# EAGLE design MPU (EAGLE 7.2.0)

## Sheet 1 of 2
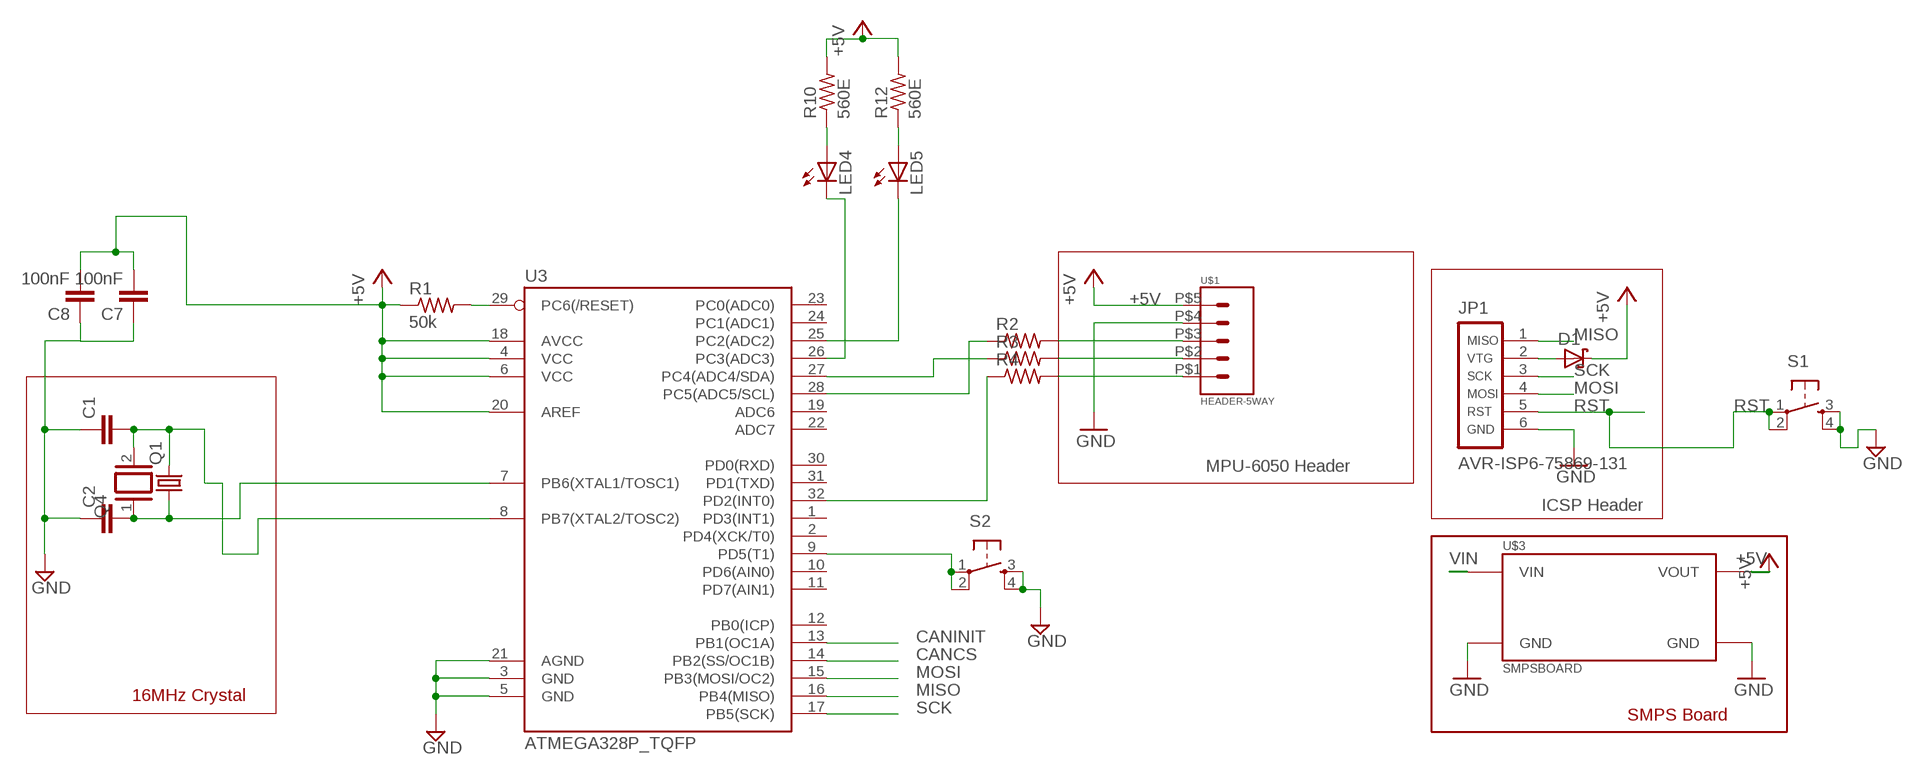
[diagram p0: schematic, sheet 1]

### Parts
C1  C-EUC0805  [C0805]
C2  C-EUC0805  [C0805]
C7  100nF  C-EUC0805  [C0805]
C8  100nF  C-EUC0805  [C0805]
D1  SCHOTTKY-DIODESMD  [SMB]
JP1  AVR-ISP6-75869-131  [HDR-75869-131]
LED4  LEDCHIP-LED0805  [CHIP-LED0805]
LED5  LEDCHIP-LED0805  [CHIP-LED0805]
Q1  CRYSTALHC49UP  [HC49UP]
Q4  XTAL/S  [QS]
R1  50k  R-US_M0805  [M0805]
R2  R-US_M0805  [M0805]
R3  R-US_M0805  [M0805]
R4  R-US_M0805  [M0805]
R10  560E  R-US_M0805  [M0805]
R12  560E  R-US_M0805  [M0805]
S1  TAC_SWITCHSMD  [TACTILE_SWITCH_SMD]
S2  TAC_SWITCHSMD  [TACTILE_SWITCH_SMD]
U3  ATMEGA328P_TQFP  [TQFP32-08]
U$1  HEADER-5WAY  [1744426-5]
U$3  SMPSBOARD  [SMPSBOARD]

### Nets
+5V: C7.2 C8.2 D1.C R1.1 R10.2 R12.2 U3.4(VCC) U3.6(VCC) U3.18(AVCC) U3.20(AREF) U$1.P$5 U$3.VOUT ; also sheet 2
CANCS: U3.14(PB2(SS/OC1B)) ; also sheet 2
CANINIT: U3.13(PB1(OC1A))
GND: C1.1 C2.1 C7.1 C8.1 JP1.6 S1.3 S1.4 S2.3 S2.4 U3.3(GND) U3.5(GND) U3.21(AGND) U$1.P$4 U$3.GND U$3.GND@(GND) ; also sheet 2
INT: R4.2 U$1.P$1
MISO: JP1.1 U3.16(PB4(MISO)) ; also sheet 2
MOSI: JP1.4 U3.15(PB3(MOSI/OC2)) ; also sheet 2
N$5: R2.1 U3.28(PC5(ADC5/SCL))
N$6: R3.1 U3.27(PC4(ADC4/SDA))
N$7: R4.1 U3.32(PD2(INT0))
N$8: LED5.C U3.25(PC2(ADC2))
N$9: C2.2 Q1.1 Q4.1 U3.7(PB6(XTAL1/TOSC1))
N$10: S2.1 S2.2 U3.9(PD5(T1))
N$11: R1.2 U3.29(PC6(/RESET))
N$12: LED4.A R10.1
N$14: LED5.A R12.1
N$15: LED4.C U3.26(PC3(ADC3))
N$16: D1.A JP1.2
N$17: C1.2 Q1.2 Q4.2 U3.8(PB7(XTAL2/TOSC2))
RST: JP1.5 S1.1 S1.2
SCK: JP1.3 U3.17(PB5(SCK)) ; also sheet 2
SCL: R2.2 U$1.P$3
SDA: R3.2 U$1.P$2
VIN: U$3.VIN ; also sheet 2
Unconnected: U3.1(PD3(INT1)) U3.2(PD4(XCK/T0)) U3.10(PD6(AIN0)) U3.11(PD7(AIN1)) U3.12(PB0(ICP)) U3.19(ADC6) U3.22(ADC7) U3.23(PC0(ADC0)) U3.24(PC1(ADC1)) U3.30(PD0(RXD)) U3.31(PD1(TXD))

### Notes on the sheet
- MPU-6050 Header
- ICSP Header
- 16MHz Crystal
- SMPS Board

## Sheet 2 of 2
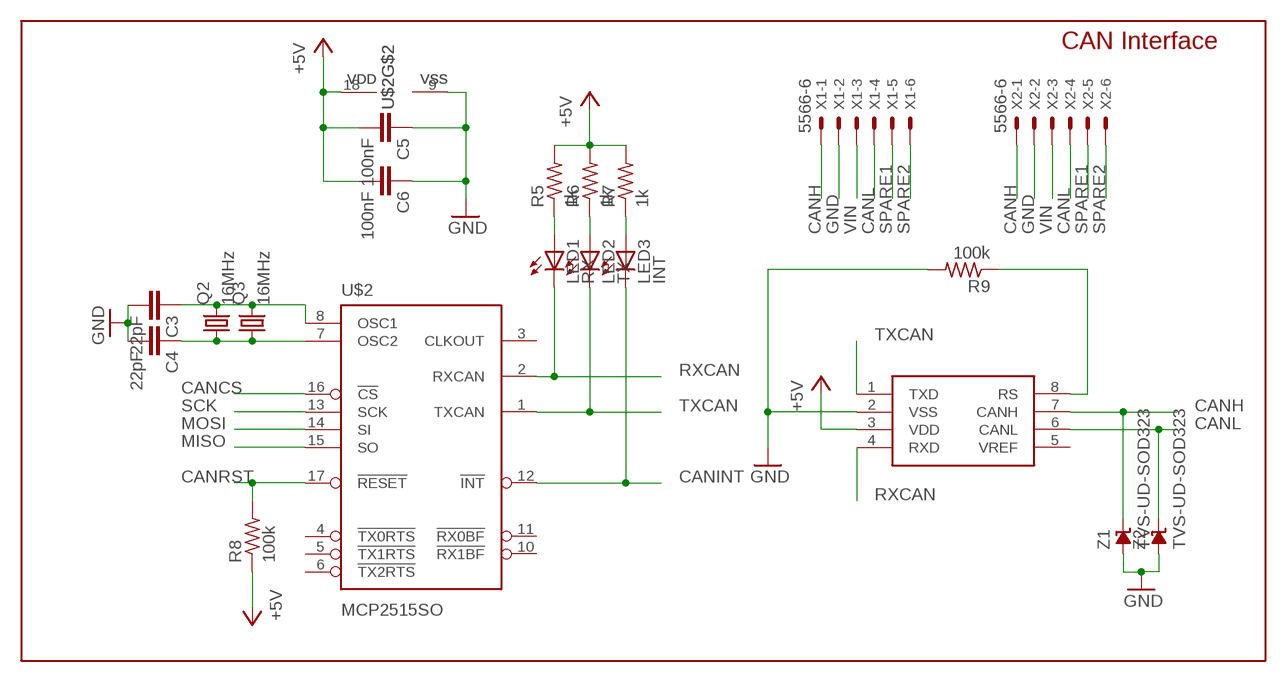
[diagram p1: schematic, sheet 2]

### Parts
C3  22pF  C-EUC0805K  [C0805K]
C4  22pF  C-EUC0805K  [C0805K]
C5  100nF  C-EUC0805K  [C0805K]
C6  100nF  C-EUC0805K  [C0805K]
LED1  RX  LEDCHIP-LED0805  [CHIP-LED0805]
LED2  TX  LEDCHIP-LED0805  [CHIP-LED0805]
LED3  INT  LEDCHIP-LED0805  [CHIP-LED0805]
Q2  16MHz  CRYSTALHC49S  [HC49/S]
Q3  16MHz  CRYSTALHC49UP  [HC49UP]
R5  1k  R-US_R0805  [R0805]
R6  1k  R-US_R0805  [R0805]
R7  1k  R-US_R0805  [R0805]
R8  100k  R-US_R0805  [R0805]
R9  100k  R-US_R0805  [R0805]
U2  MCP2551  [SO08]
U$2  MCP2515SO  [SO-18W]
X1  5566-6  [5566-6]
X2  5566-6  [5566-6]
Z1  TVS-UD-SOD323  [SOD323]
Z2  TVS-UD-SOD323  [SOD323]

### Nets
+5V: C5.2 C6.2 R5.2 R6.2 R7.2 R8.1 U2.3(VDD) U$2.18(VDD) ; also sheet 1
CANCS: U$2.16(!CS) ; also sheet 1
CANH: U2.7(CANH) X1.1 X2.1 Z1.C
CANINT: LED3.C U$2.12(!INT)
CANL: U2.6(CANL) X1.4 X2.4 Z2.C
CANRST: R8.2 U$2.17(!RESET)
CANSTBY: R9.1 U2.8(RS)
GND: C3.2 C4.2 C5.1 C6.1 R9.2 U2.2(VSS) U$2.9(VSS) X1.2 X2.2 Z1.A Z2.A ; also sheet 1
MISO: U$2.15(SO) ; also sheet 1
MOSI: U$2.14(SI) ; also sheet 1
N$1: LED1.A R5.1
N$2: LED2.A R6.1
N$3: LED3.A R7.1
N$4: C3.1 Q2.2 Q3.2 U$2.8(OSC1)
N$13: C4.1 Q2.1 Q3.1 U$2.7(OSC2)
RXCAN: LED1.C U2.4(RXD) U$2.2(RXCAN)
SCK: U$2.13(SCK) ; also sheet 1
SPARE1: X1.5 X2.5
SPARE2: X1.6 X2.6
TXCAN: LED2.C U2.1(TXD) U$2.1(TXCAN)
VIN: X1.3 X2.3 ; also sheet 1
Unconnected: U2.5(VREF) U$2.3(CLKOUT) U$2.4(!TX0RTS) U$2.5(!TX1RTS) U$2.6(!TX2RTS) U$2.10(!RX1BF) U$2.11(!RX0BF)

### Notes on the sheet
- CAN Interface

## Library data of the parts
C1-C8 = resistor:C-EU: CAPACITOR, European symbol
D1 = diode:SCHOTTKY-DIODE: Schottky Diode
JP1 = atmel-avr:AVR-ISP6-: AVR ISP-6 Serial Programming Header
LED1-LED5 = led:LED: LED OSRAM: - CHIPLED LG R971, LG N971, LY N971, LG Q971, LY Q971, LO R971, LY R971 LH N974, LH R974 LS Q976, LO Q976, LY Q976 LO Q996 - Hyper CHIPLED LW Q18S LB Q993, LB Q99A, LB R99A - SideLED LS A670, LO A670, LY A670, LG A670, LP A670 LB A673, LV A673, LT A673, LW A673 LH A674 LY A675 LS A676, LA A676, LO A676, LY A676, LW A676 LS A679, LY A679, LG A679 - Hyper Micro SIDELED® LS Y876, LA Y876, LO Y876, LY Y876 LT Y87S - SmartLED LW L88C, LW L88S LB L89C, LB L89S, LG L890 LS L89K, LO L89K, LY L89K LS L896, LA L896, LO L896, LY L896 - TOPLED LS T670, LO T670, LY T670, LG T670, LP T670 LSG T670, LSP T670, LSY T670, LOP T670, LYG T670 LG T671, LOG T671, LSG T671 LB T673, LV T673, LT T673, LW T673 LH T674 LS T676, LA T676, LO T676, LY T676, LB T676, LH T676, LSB T676, LW T676 LB T67C, LV T67C, LT T67C, LS T67K, LO T67K, LY T67K, LW E67C LS E67B, LA E67B, LO E67B, LY E67B, LB E67C, LV E67C, LT E67C LW T67C LS T679, LY T679, LG T679 LS T770, LO T770, LY T770, LG T770, LP T770 LB T773, LV T773, LT T773, LW T773 LH T774 LS E675, LA E675, LY E675, LS T675 LS T776, LA T776, LO T776, LY T776, LB T776 LHGB T686 LT T68C, LB T68C - Hyper Mini TOPLED® LB M676 - Mini TOPLED Santana® LG M470 LS M47K, LO M47K, LY M47K Source: http://www.osram.convergy.de LUXEON: - LUMILED® LXK2-PW12-R00, LXK2-PW12-S00, LXK2-PW14-U00, LXK2-PW14-V00 LXK2-PM12-R00, LXK2-PM12-S00, LXK2-PM14-U00 LXK2-PE12-Q00, LXK2-PE12-R00, LXK2-PE12-S00, LXK2-PE14-T00, LXK2-PE14-U00 LXK2-PB12-K00, LXK2-PB12-L00, LXK2-PB12-M00, LXK2-PB14-N00, LXK2-PB14-P00, LXK2-PB14-Q00 LXK2-PR12-L00, LXK2-PR12-M00, LXK2-PR14-Q00, LXK2-PR14-R00 LXK2-PD12-Q00, LXK2-PD12-R00, LXK2-PD12-S00 LXK2-PH12-R00, LXK2-PH12-S00 LXK2-PL12-P00, LXK2-PL12-Q00, LXK2-PL12-R00 Source: www.luxeon.com KINGBRIGHT: KA-3528ASYC Source: www.kingbright.com
Q1 Q3 = crystal:CRYSTAL: CRYSTAL; OC_FARNELL: unknown; OC_NEWARK: unknown
Q2 = crystal:CRYSTAL: CRYSTAL; OC_FARNELL: 1667008; OC_NEWARK: unknown
Q4 = special:XTAL/S: CRYSTAL
R1-R10 R12 = resistor:R-US_: RESISTOR, American symbol
S1 S2 = SparkFun:TAC_SWITCH: Momentary Switch Button commonly used for reset or general input. Spark Fun Electronics SKU : COM-00097
U2 = SparkFun:MCP2551
U3 = SparkFun-DigitalIC:ATMEGA328P_TQFP; PROD_ID: IC-09069
U$1 = con-TE-EP:HEADER-5WAY
U$2 = RobThePyro:MCP2515: MCP2515 CAN Controller by Microchip
U$3 = RobThePyro:SMPSBOARD
X1 X2 = con-molex:5566-6: Mini FIT connector 6 pol Source: http://www.molex.com; MPN: 95566-61002; OC_FARNELL: unknown; OC_NEWARK: 22K8620
Z1 Z2 = supressor:TVS-UD-: TVS UNI-DIRECTIONAL

## Board
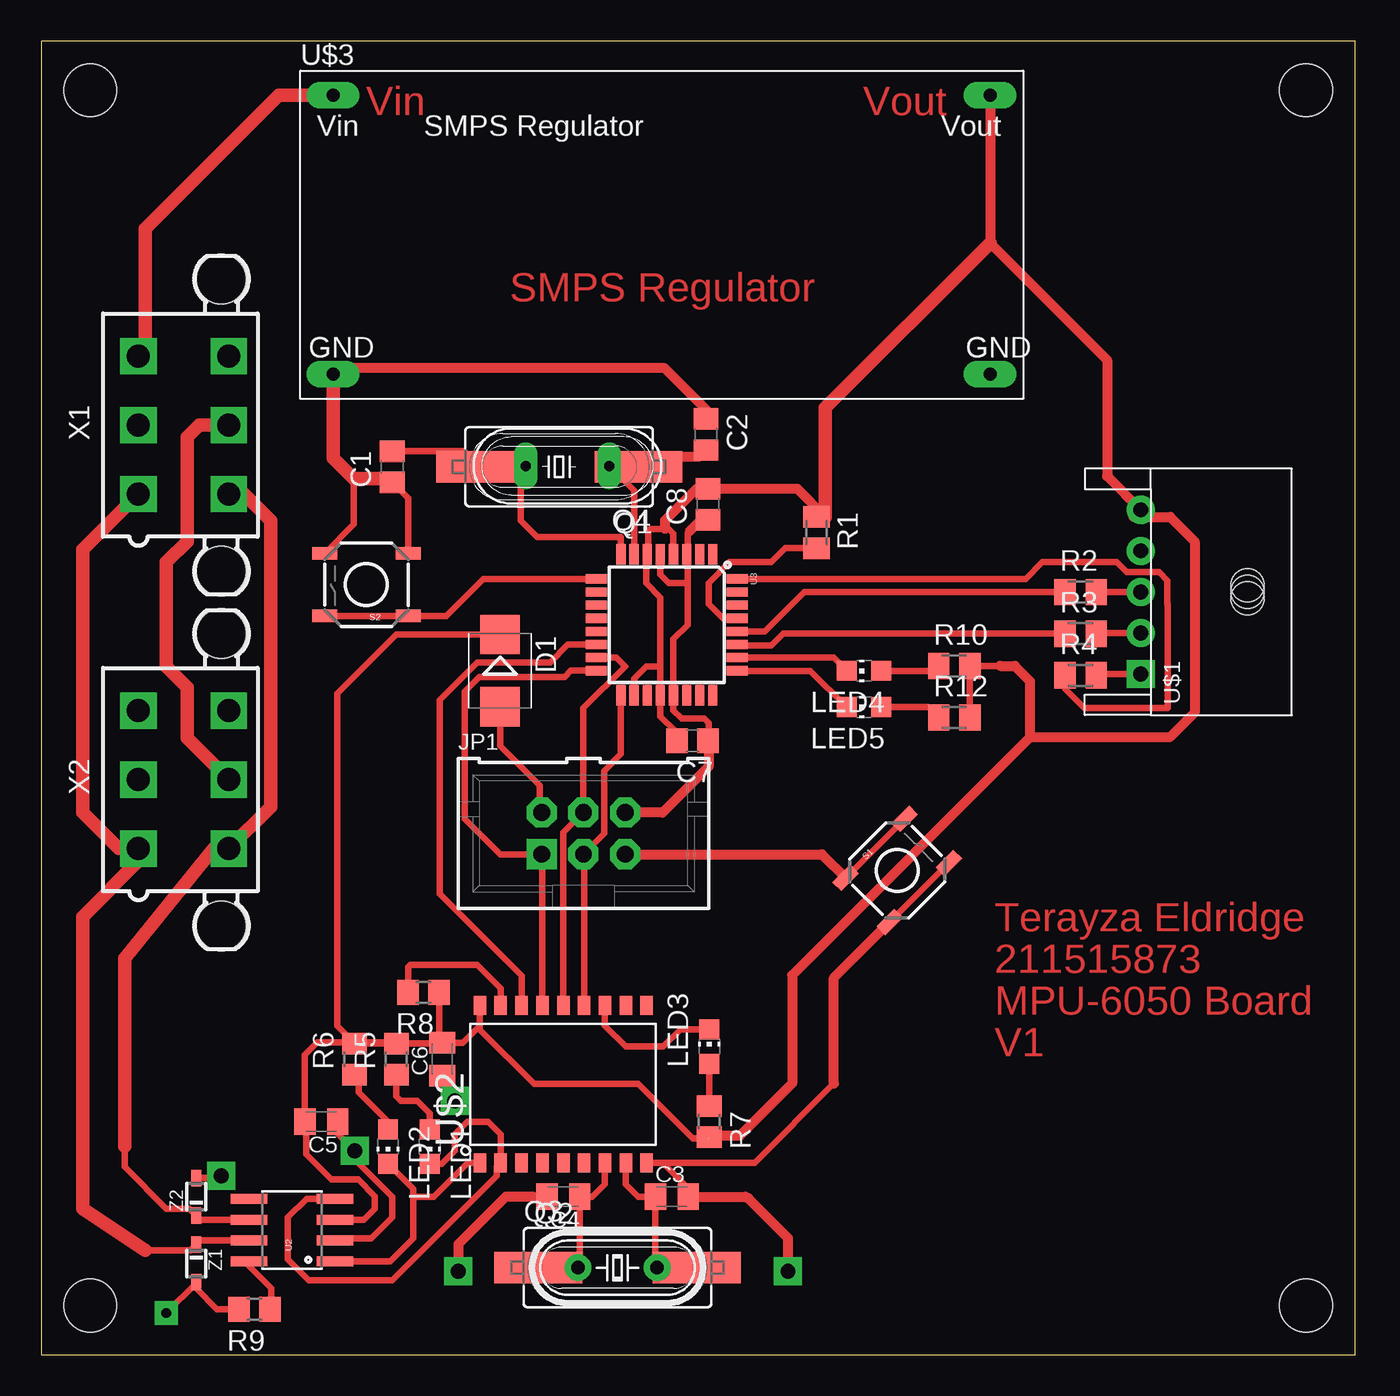
[diagram p2: board, top side]
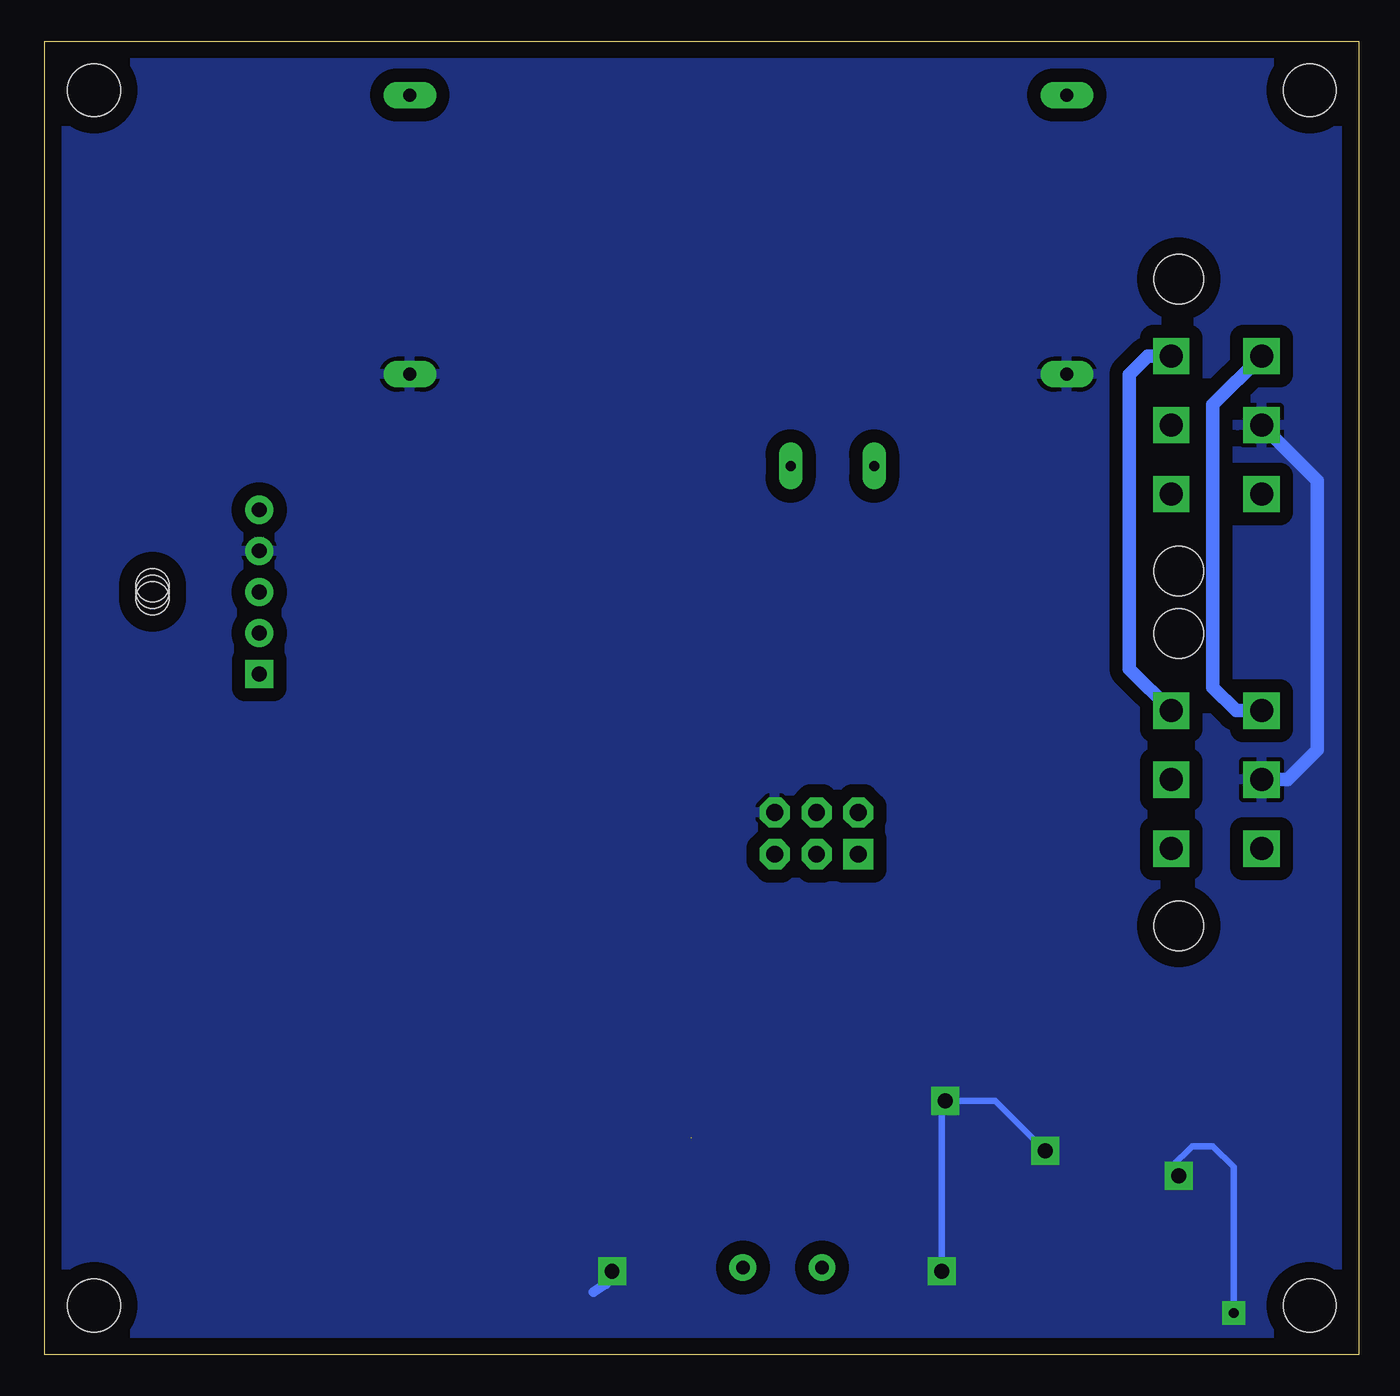
[diagram p3: board, bottom side, seen from below]

Size 80 x 80 mm. Coordinates in mm from the lower left corner, seen from the top.
Outline: 0,0 80,0 80,80 0,80 0,0
Copper layers (1*16): Top 0.035mm / dielectric 1.5mm / Bottom 0.035mm
Design rules "default *": minimum track width 10mil, minimum drill 24mil, track to track 8mil, track to pad 8mil, pad to pad 8mil, via to via 8mil, smd to smd 8mil, copper to edge 40mil, drill to drill 8mil, minimum pad ring 16mil, minimum via ring 16mil, stop-mask expansion 4mil, vias tented up to drill 0mil, thermal gap 10mil
Holes 3.2 mm at 3,3 77,3 77,77 3,77

### Footprints (pad centres in the part's own frame; a part is rotated, then mirrored left to right if it is on the bottom)
C0805 = smd 1.3 x 1.5: 1 -0.95,0; 2 0.95,0
C0805K = smd 1.3 x 1.6: 1 -1,0; 2 1,0
SMB = smd 2.4 x 2.4: A 2.2,0; C -2.2,0
HDR-75869-131 = drill 1.016 pad 1.676 square: 1 -2.54,-1.27 | drill 1.016 pad 1.676 octagon: 2 -2.54,1.27; 3 0,-1.27; 4 0,1.27; 5 2.54,-1.27; 6 2.54,1.27
CHIP-LED0805 = smd 1.2 x 1.2: A 0,-1.05; C 0,1.05
HC49UP = smd 5.334 x 1.93: 1 -4.826,0; 2 4.826,0
HC49/S = drill 0.813: 1 -2.413,0; 2 2.413,0
QS = drill 0.61 long: 1 -2.54,0; 2 2.54,0
M0805 = smd 1.3 x 1.6: 1 -0.95,0; 2 0.95,0
R0805 = smd 1.3 x 1.5: 1 -0.95,0; 2 0.95,0
TACTILE_SWITCH_SMD = smd 1.524 x 0.762: 1 -2.54,1.905; 2 2.54,1.905; 3 -2.54,-1.905; 4 2.54,-1.905
SO08 = smd 0.61 x 2.21: 1 -1.905,-2.616; 2 -0.635,-2.616; 3 0.635,-2.616; 4 1.905,-2.616; 5 1.905,2.616; 6 0.635,2.616; 7 -0.635,2.616; 8 -1.905,2.616
TQFP32-08 = smd 1.27 x 0.559: 1 -4.293,2.8; 2 -4.293,2; 3 -4.293,1.2; 4 -4.293,0.4; 5 -4.293,-0.4; 6 -4.293,-1.2; 7 -4.293,-2; 8 -4.293,-2.8; 17 4.293,-2.8; 18 4.293,-2; 19 4.293,-1.2; 20 4.293,-0.4; 21 4.293,0.4; 22 4.293,1.2; 23 4.293,2; 24 4.293,2.8 | smd 0.559 x 1.27: 9 -2.8,-4.293; 10 -2,-4.293; 11 -1.2,-4.293; 12 -0.4,-4.293; 13 0.4,-4.293; 14 1.2,-4.293; 15 2,-4.293; 16 2.8,-4.293; 25 2.8,4.293; 26 2,4.293; 27 1.2,4.293; 28 0.4,4.293; 29 -0.4,4.293; 30 -1.2,4.293; 31 -2,4.293; 32 -2.8,4.293
1744426-5 = drill 0.9 square: P$1 -5,6.5 | drill 0.9: P$2 -2.5,6.5; P$3 0,6.5; P$4 2.5,6.5; P$5 5,6.5 | hole 2: 0,0; -0.4,0; 0.4,0
SO-18W = smd 0.762 x 1.143: 1 -5.08,-4.788; 2 -3.81,-4.788; 3 -2.54,-4.788; 4 -1.27,-4.788; 5 0,-4.788; 6 1.27,-4.788; 7 2.54,-4.788; 8 3.81,-4.788; 9 5.08,-4.788; 10 5.08,4.788; 11 3.81,4.788; 12 2.54,4.788; 13 1.27,4.788; 14 0,4.788; 15 -1.27,4.788; 16 -2.54,4.788; 17 -3.81,4.788; 18 -5.08,4.788
SMPSBOARD = drill 0.8 long: GND 2,1.5; GND@ 42,1.5; VIN 2,18.5; VOUT 42,18.5
5566-6 = drill 1.4 square: 1 4.2,-2.75; 2 0,-2.75; 3 -4.2,-2.75; 4 4.2,2.75; 5 0,2.75; 6 -4.2,2.75 | hole 3: 8.9,2.29; -8.9,2.29
SOD323 = smd 1 x 0.6: A 1.143,0; C -1.143,0

### Placement (x,y rotation side)
C1  21.38,54.07 90 top
C2  40.47,56.04 270 top
C3  38.39,9.62 0 top
C4  31.79,9.62 180 top
C5  17.06,14.19 180 top
C6  24.42,18 90 top
C7  39.65,37.39 180 top
C8  40.61,51.79 90 top
D1  27.94,41.66 270 top
JP1  33.02,31.75 0 top
LED1  23.66,12.67 180 top
LED2  21.12,12.67 180 top
LED3  40.68,18.77 0 top
LED4  50.1,41.65 90 top
LED5  50.1,39.44 90 top
Q1  31.54,54.07 180 top
Q2  35.09,5.3 0 top
Q3  35.09,5.3 0 top
Q4  32.05,54.12 180 top
R1  47.2,50.07 270 top
R2  63.29,46.45 0 top
R3  63.29,43.91 0 top
R4  63.29,41.37 0 top
R5  21.63,18 90 top
R6  19.09,18 90 top
R7  40.68,14.19 270 top
R8  23.28,22.07 180 top
R9  12.99,2.76 180 top
R10  55.6,41.94 0 top
R12  55.6,38.8 0 top
S1  52.12,29.49 45 top
S2  19.8,46.9 180 top
U2  15.28,7.59 90 top
U3  38.1,44.45 270 top
U$1  73.45,46.45 90 top
U$2  31.79,16.48 0 top
U$3  15.78,58.21 0 top
X1  8.68,56.61 270 top
X2  8.68,35.02 270 top
Z1  9.44,5.56 270 top
Z2  9.44,9.62 90 top

### Tracks (layer width: path | path; a pad name or v marks a point on that pad's centre or on a via)
+5V  (1 unrouted)
  Top 0.406: R6.2 R5.2 24.38,18.95 C6.2 | R6.2 21.06,19.02 16.8,19.02 16.06,18.27 C5.2 16.13,14.12 16.13,12.19 17.65,10.67 19.3,10.67 20.32,9.65 20.32,8.89 19.66,8.22 U2.3 | 26.71,20.04 26.71,19.78 30.01,16.48 36.36,16.48 39.66,13.18 40.62,13.18 R7.2 | 26.71,20.04 U$2.18 | C6.2 25.68,19 26.71,20.04 | 37.7,41.91 U3.20 37.7,38.88 38.61,37.97 38.61,37.48 C7.2 | 37.7,41.91 37.7,46.12 36.83,46.99 36.83,48.67 U3.6 36.96,48.8 36.96,50.16 37.08,50.29 37.97,50.29 38.23,50.29 38.5,50.02 U3.4 | R12.2 R10.2 58.39,41.94 | U3.18 36.1,41.18 36.83,41.91 37.7,41.91 | 66.04,52.36 U$1.P$5 | R8.1 24.23,19.2 C6.2 | D1.C 21.63,43.86 18.03,40.26 18.03,20.01 R6.2
  Top 0.61: U$3.VOUT 57.78,67.7 64.9,60.58 64.9,53.5 U$1.P$5 66.51,51.02 68.74,51.02 70.23,49.53 70.23,39.12 68.71,37.59 60.2,37.59 | R1.1 47.75,51.02 46.03,52.74 C8.2 39.91,52.74 37.97,50.8 37.97,50.29 | 60.2,37.59 45.72,23.11 45.72,16.51 42.55,13.34 40.77,13.34 40.64,13.21 | 58.39,41.94 59.28,41.94 60.2,41.02 60.2,37.59
  Top 0.813: 47.75,51.02 47.75,57.67 57.78,67.7
CANCS
  Top 0.406: U$2.16 29.25,23.07 24.26,28.07 24.26,39.88 26.54,42.16 30.99,42.16 32.07,43.25 U3.14
CANH
  Top 0.406: U2.7 9.69,6.96 Z1.C 9.09,6.35 6.35,6.35
  Top 0.813: X1.1 2.54,49.02 2.54,33.02 4.74,30.82 X2.1 5.93,30.06 2.54,26.67 2.54,8.89 6.35,6.35
CANINT
  Top 0.406: LED3.C 38.94,19.82 37.89,18.77 35.6,18.77 34.33,20.04 U$2.12
CANL
  Top 0.406: U2.6 9.69,8.22 Z2.C 9.03,8.89 7.62,8.89 5.08,11.43 5.08,12.7
  Top 0.813: X1.4 12.36,52.41 13.97,50.8 13.97,33.37 X2.4 10.5,30.82 5.08,24.13 5.08,12.7
CANRST
  Top 0.406: U$2.17 27.98,22.31 26.54,23.75 22.48,23.75 22.35,23.62 22.35,22.09 R8.2
CANSTBY
  Top 0.406: U2.8 12.66,5.38 14.01,4.03 14.01,2.83 R9.1
GND  (via drill 0.6, 0.9, 0.9 pad 1.42)
  Top 0.406: U$2.9 37.85,11.69 | R9.2 10.71,2.76 9.44,4.03 Z1.A 9.44,4.36 v7.62,2.54 | C6.1 24.43,16.23 v25.19,15.46 | Z2.A 10.84,10.77 v10.96,10.89 | C5.1 18.06,13.45 v19.09,12.42 19.09,11.91 21.38,9.62 21.38,8.35 20.11,7.08 18.02,7.08 U2.2 | 39.37,47.12 39.37,44.45 38.5,43.58 U3.21 38.48,40.14 38.48,39.24 38.99,38.73 40.39,38.73 40.64,38.48 40.64,37.42 C7.1 | 39.37,47.12 39.37,48.67 U3.3 39.37,48.81 39.37,50.04 39.5,50.16 | S1.4 52.03,26.71 S1.3 | 19.05,53.34 19.05,50.59 S2.4 | S2.3 22.34,52.16 C1.1 | C4.2 29.94,9.62 | U$2.9 43.44,11.69 48.26,16.51 | U$2.9 37.84,11.69 39.37,10.16 39.37,9.65 C3.2 | U3.5 37.7,47.52 38.23,46.99 39.24,46.99 39.37,47.12
  Top 0.61: C2.1 40.47,57.57 37.97,60.07 18.14,60.07 U$3.GND | 39.5,50.16 40.17,50.84 C8.1 | C7.1 40.64,37.35 40.64,35.81 37.85,33.02 JP1.6 | 55.34,29.94 S1.4 | 48.26,16.51 48.26,22.93 52.03,26.71 | 29.94,9.62 28.29,9.62 25.4,6.73 v25.4,5.08 | C3.2 42.9,9.62 43.05,9.53 45.47,7.11 v45.47,5.08
  Top 0.813: U$3.GND 17.78,54.61 19.05,53.34 21.16,53.34 C1.1
  Bottom 0.406: v7.62,2.54 7.62,11.43 8.89,12.7 10.16,12.7 11.43,11.43 11.43,11.36 v10.96,10.89 | v19.09,12.42 22.14,15.46 v25.19,15.46 25.4,15.25 v25.4,5.08
  Bottom 0.61: v45.47,5.08 45.85,4.32 46.61,3.81
  Bottom 0.813: X2.2 4.35,35.02 2.54,36.83 2.54,53.23 X1.2
  pour Bottom (isolate 0.813): 0,0 80,0 80,80 0,80
INT
  Top 0.406: U$1.P$1 64.32,41.45 R4.2
MISO
  Top 0.406: U$2.15 30.52,30.44 JP1.1 27.94,30.48 25.78,32.64 25.78,40.39 26.67,41.27 31.88,41.27 32.26,41.66 U3.16
MOSI
  Top 0.406: U$2.14 31.79,31.79 JP1.4 33.02,39.37 35.56,41.91 35.02,42.45 U3.15
N$1
  Top 0.406: LED1.A 23.66,14.7 22.9,15.46 21.89,15.46 21.63,15.72 R5.1
N$2
  Top 0.406: LED2.A 21.12,14.19 19.34,15.97 19.34,16.8 R6.1
N$3
  Top 0.406: LED3.A R7.1
N$4
  Top 0.406: Q3.2 Q2.2 37.4,5.3 C3.1 36.36,9.62 35.6,10.38 U$2.8
N$5
  Top 0.406: R2.1 46.45,46.45 44.05,44.05 U3.28
N$6
  Top 0.406: R3.1 45.18,43.91 44.45,43.18 42.46,43.18 U3.27
N$7
  Top 0.406: R4.1 62.34,40.53 63.5,39.37 68.58,39.37 68.58,45.72 68.57,45.73 68.57,47.14 68.06,47.65 66.08,47.65 65.47,48.26 60.96,48.26 59.95,47.25 U3.32
N$8
  Top 0.406: U3.25 46.84,41.65 LED5.C
N$9
  Top 0.406: Q1.1 34.65,54.07 Q4.1 | U3.7 36.1,52.62 Q4.1 | 35.18,54.71 Q4.1
  Top 0.61: 35.18,54.71 40.09,54.71 C2.2
N$10
  Top 0.406: S2.2 S2.1 24.67,44.99 26.93,47.25 U3.9
N$11
  Top 0.406: U3.29 41.51,44.85 40.64,45.72 40.64,46.99 41.91,48.26 44.45,48.26 45.31,49.12 R1.2
N$12
  Top 0.406: LED4.A 54.35,41.65 R10.1
N$13
  Top 0.406: Q3.1 Q2.1 32.79,5.3 C4.1 33.57,9.62 34.33,10.38 U$2.7
N$14
  Top 0.406: LED5.A 54.01,39.44 R12.1
N$15
  Top 0.406: U3.26 48.24,42.45 LED4.C
N$16
  Top 0.406: D1.A 27.94,37.08 30.35,34.67 30.35,33.15 JP1.2
N$17
  Top 0.406: U3.8 35.3,49.79 30.22,49.79 29.21,50.8 29.21,53.82 Q4.2 29.46,54.07 Q1.2 25.76,55.02 C1.2
RST
  Top 0.406: S1.2 S1.1
  Top 0.61: JP1.5 47.54,30.48 S1.1
RXCAN
  Top 0.406: LED1.C 24.39,11.62 25.19,12.42 25.19,13.43 25.95,14.19 27.22,14.19 27.98,13.43 U$2.2 27.73,11.44 27.73,10.89 21.38,4.54 16.3,4.54 15.03,5.81 15.03,8.35 16.17,9.49 U2.4
SCK
  Top 0.406: U$2.13 33.06,30.44 JP1.3 34.29,31.75 34.29,35.56 35.3,36.57 U3.17
SCL
  Top 0.406: U$1.P$3 R2.2
SDA
  Top 0.406: U$1.P$2 64.28,43.95 R3.2
SPARE1
  Top 0.813: X1.5 9.62,56.61 8.89,55.88 8.89,49.53 7.62,48.26 7.62,41.91 8.89,40.64 8.89,37.56 X2.5
SPARE2
  Bottom 0.813: X1.6 12.85,60.81 13.97,59.69 13.97,41.77 X2.6
TXCAN
  Top 0.406: U2.1 21.25,5.68 22.65,7.08 22.65,9.62 | 22.65,9.62 22.65,10.1 LED2.C | U$2.1 25.99,11.69 23.92,9.62 22.65,9.62
VIN
  Top 0.813: U$3.VIN 14.48,76.71 6.35,68.58 6.35,61.23 X1.3
  Bottom 0.813: X2.3 7.47,39.22 8.89,40.64 8.89,57.85 X1.3

### Text on the board
Top: Vin | Vout | SMPS Regulator | Terayza Eldridge | 211515873 | MPU-6050 Board | V1
200bmp: C:/Users/Terayza/Desktop/teacup.bmp